# EAGLE design Arduino Engine Room (EAGLE 6.2)
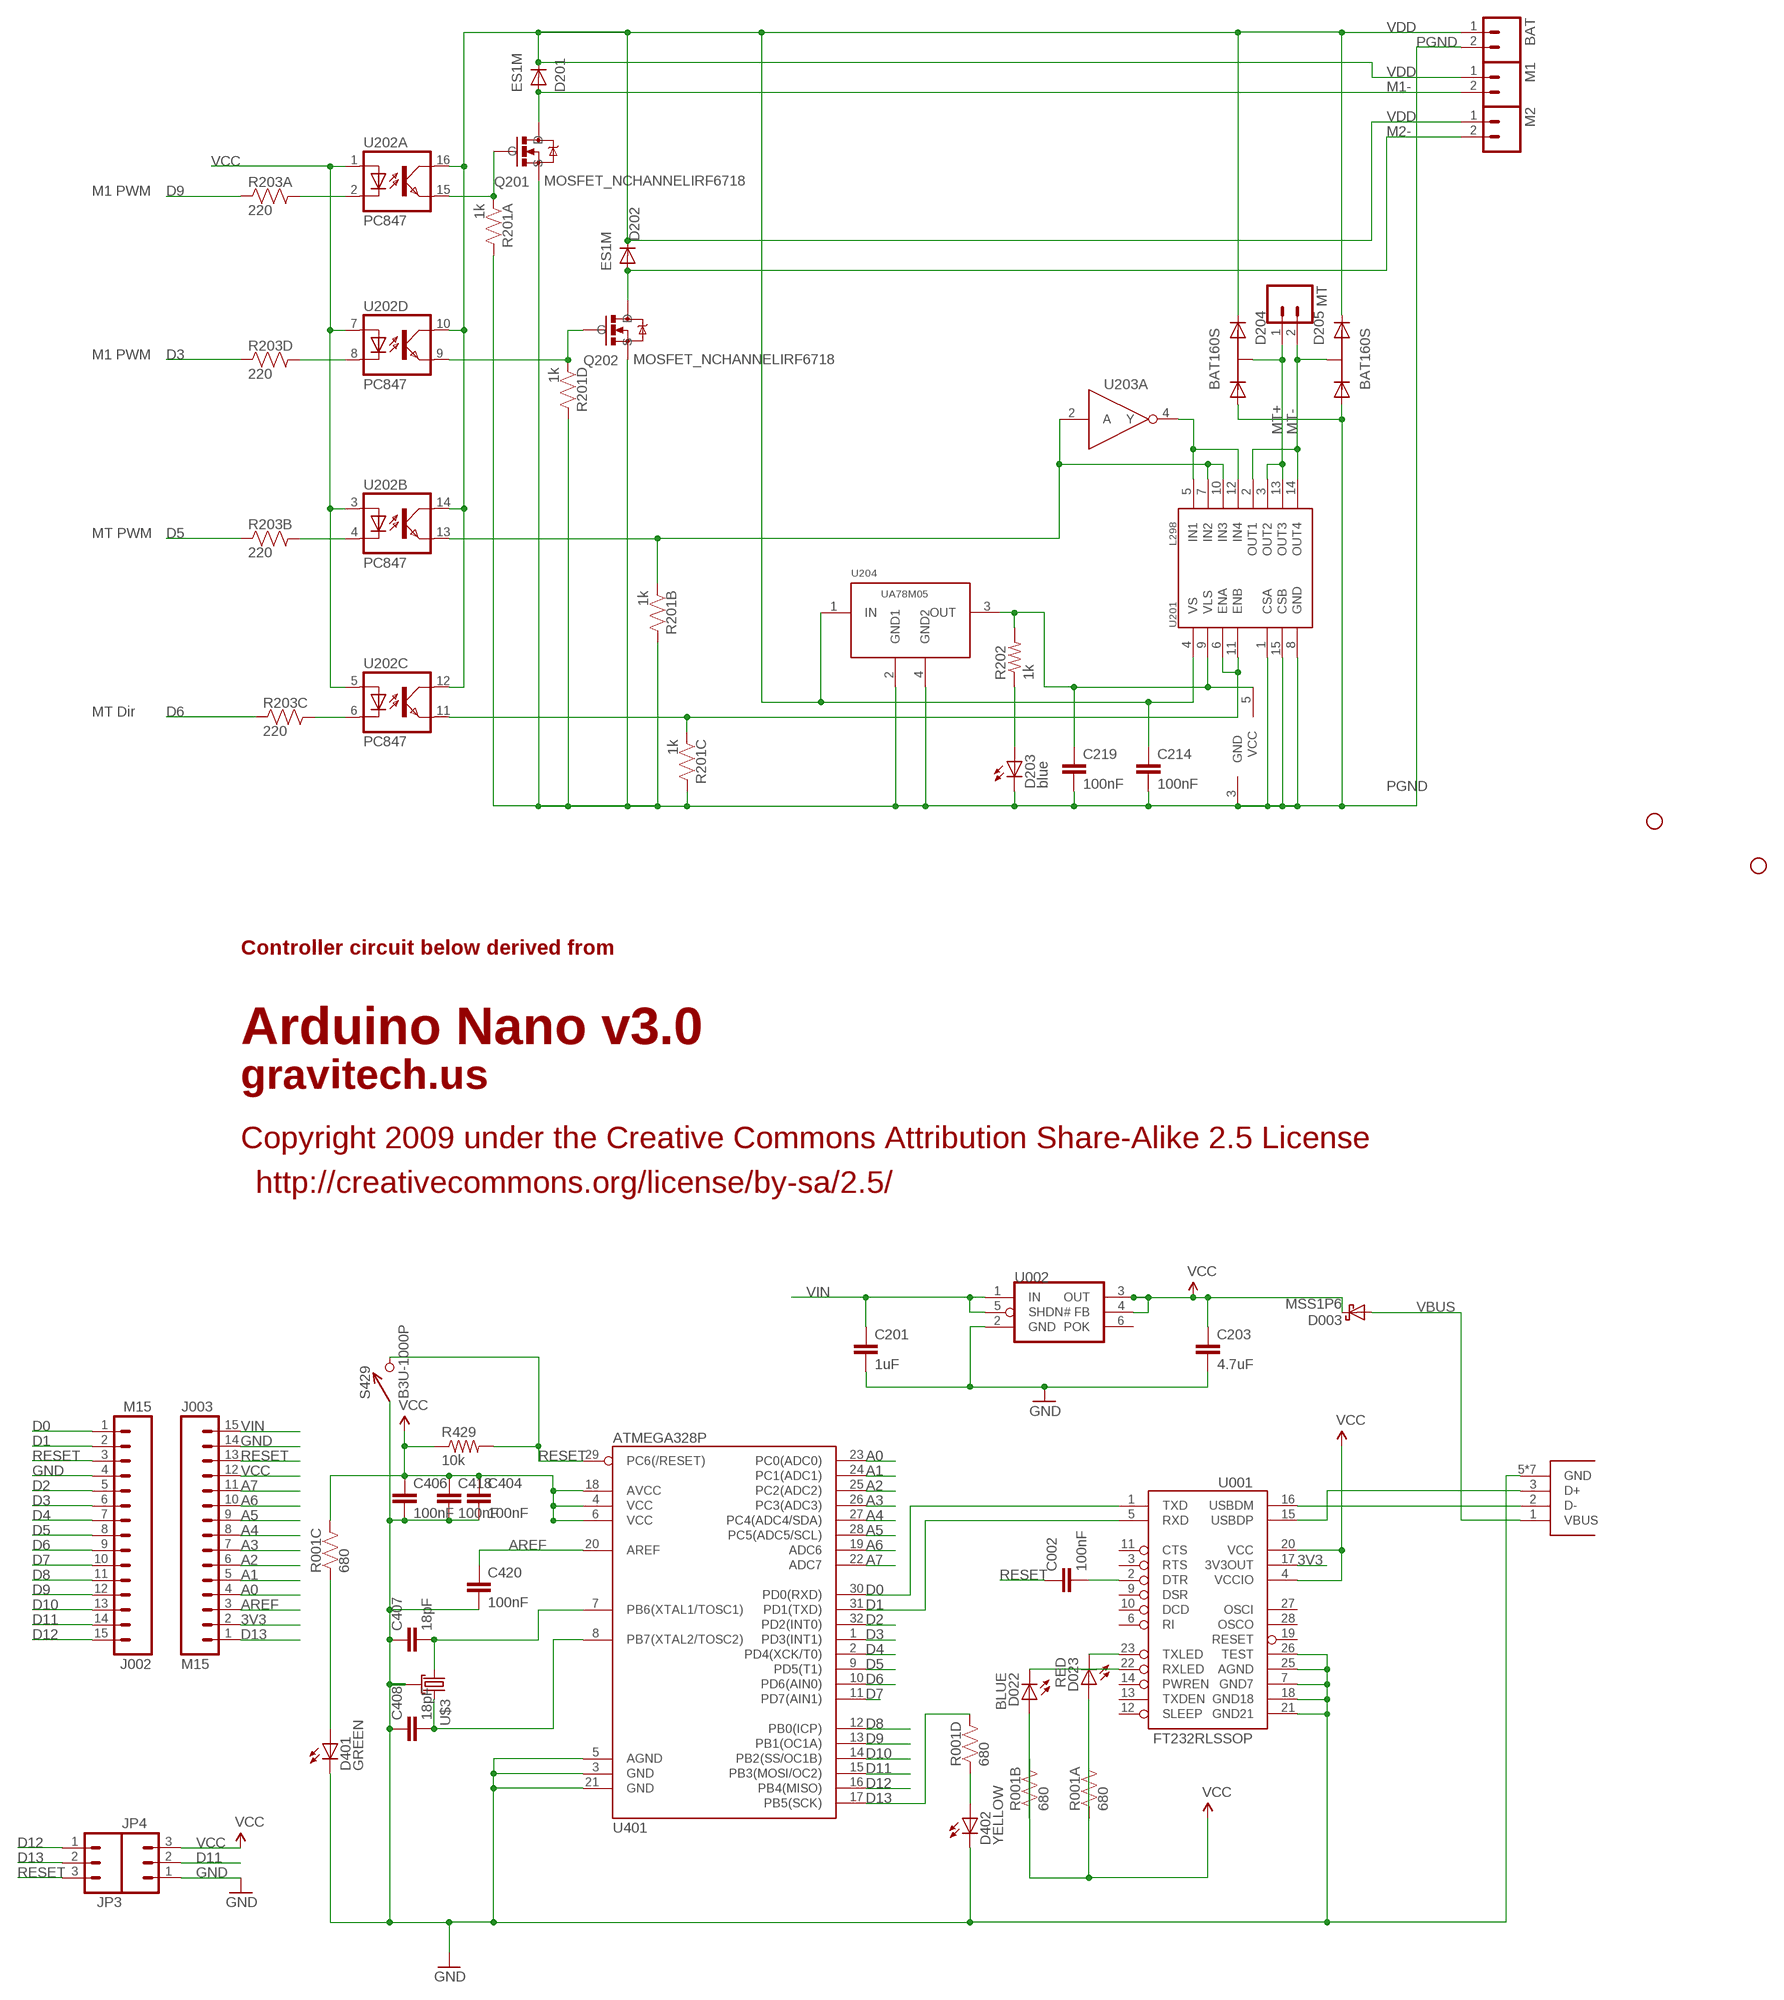
[diagram p0: schematic, sheet 1]

## Parts
BAT  M02PTH4  [1X02_XTRA_BIG]
C002  100nF  CAP0402-CAP  [0402-CAP]
C201  1uF  CAP0402-CAP  [0402-CAP]
C203  4.7uF  CAP0402-CAP  [0402-CAP]
C214  100nF  CAP0402-CAP  [0402-CAP]
C219  100nF  CAP0402-CAP  [0402-CAP]
C404  100nF  CAP0402-CAP  [0402-CAP]
C406  100nF  CAP0402-CAP  [0402-CAP]
C407  18pF  CAP0402-CAP  [0402-CAP]
C408  18pF  CAP0402-CAP  [0402-CAP]
C418  100nF  CAP0402-CAP  [0402-CAP]
C420  100nF  CAP0402-CAP  [0402-CAP]
D003  MSS1P6  [MICROSMP]
D022  BLUE  LED0603  [LED-0603]
D023  RED  LED0603  [LED-0603]
D201  ES1M  DIODE-DO-214AC  [DO-214AC]
D202  ES1M  DIODE-DO-214AC  [DO-214AC]
D203  blue  LED0603  [LED-0603]
D204  BAT160S  [SOT-223]
D205  BAT160S  [SOT-223]
D401  GREEN  LED0603  [LED-0603]
D402  YELLOW  LED0603  [LED-0603]
J001  USB_MICROB_JSTGCT  [USB_MICROB_3075]
J002  M15  [1X15]
J003  M15  [1X15]
JP1  STAND-OFF  [STAND-OFF]
JP2  STAND-OFF  [STAND-OFF]
JP3  M03PTH  [1X03]
JP4  M03PTH  [1X03]
M1  M02PTH4  [1X02_XTRA_BIG]
M2  M02PTH4  [1X02_XTRA_BIG]
MT  M02PTH  [1X02]
Q201  MOSFET_NCHANNELIRF6718  [DIRECTFET_L6]
Q202  MOSFET_NCHANNELIRF6718  [DIRECTFET_L6]
R001  680  RP404  [CRA04]
R201  1k  RP404  [CRA04]
R202  1k  RESISTOR0402-RES  [0402-RES]
R203  220  RP404  [CRA04]
R429  10k  RESISTOR0402-RES  [0402-RES]
S429  B3U-1000P  [B3U-1000P]
U001  FT232RLSSOP  [SSOP28DB]
U002  MAX8881  [SOT-23-6]
U201  L298  [MULTIWATT15]
U202  PC847  [DIL16]
U203  MC74VHC1G04  [SOT-23-5]
U204  UA78M05  [SOT223]
U401  ATMEGA328P  ATMEGA168  [TQFP32-08]
U$3  CX2520  [CRYSTAL_SMD_2MM_2_5MM]

## Nets
3V3: J003.2 U001.17(3V3OUT)
A0: J003.4 U401.23(PC0(ADC0))
A1: J003.5 U401.24(PC1(ADC1))
A2: J003.6 U401.25(PC2(ADC2))
A3: J003.7 U401.26(PC3(ADC3))
A4: J003.8 U401.27(PC4(ADC4/SDA))
A5: J003.9 U401.28(PC5(ADC5/SCL))
A6: J003.10 U401.19(ADC6)
A7: J003.11 U401.22(ADC7)
AREF: C420.1 J003.3 U401.20(AREF)
D0: J002.1 U001.1(TXD) U401.30(PD0(RXD))
D1: J002.2 U001.5(RXD) U401.31(PD1(TXD))
D2: J002.5 U401.32(PD2(INT0))
D3: J002.6 R203.4 U401.1(PD3(INT1))
D3_ISO: R203.5 U202.8(D:C)
D4: J002.7 U401.2(PD4(XCK/T0))
D5: J002.8 R203.2 U401.9(PD5(T1))
D5_ISO: R203.7 U202.4(B:C)
D6: J002.9 R203.3 U401.10(PD6(AIN0))
D6_ISO: R203.6 U202.6(C:C)
D7: J002.10 U401.11(PD7(AIN1))
D8: J002.11 U401.12(PB0(ICP))
D9: J002.12 R203.1 U401.13(PB1(OC1A))
D9_ISO: R203.8 U202.2(A:C)
D10: J002.13 U401.14(PB2(SS/OC1B))
D11: J002.14 JP4.2 U401.15(PB3(MOSI/OC2))
D12: J002.15 JP3.1 U401.16(PB4(MISO))
D13: J003.1 JP3.2 R001.5 U401.17(PB5(SCK))
DTR#: C002.2 U001.2(DTR)
GND: C201.2 C203.2 C404.2 C406.2 C407.1 C408.1 C418.2 C420.2 D401.C D402.C J001.5(GND) J001.P$1(GND) J001.P$2(GND) J001.P$3(GND) J001.P$4(GND) J001.P$8(GND) J001.P$10(GND) J002.4 J003.14 JP4.1 S429.P$1 U001.7(GND7) U001.18(GND18) U001.21(GND21) U001.25(AGND) U001.26(TEST) U002.2(GND) U401.3(GND) U401.5(AGND) U401.21(GND) U$3.2(GND) U$3.4(GND)
M1- [power]: D201.A M1.2 Q201.D1(D) Q201.D2(D)
M2- [power]: D202.A M2.2 Q202.D1(D) Q202.D2(D)
MT+ [lt_power]: D204.4(K1A2) MT.1 U201.3(OUT2) U201.13(OUT3)
MT- [lt_power]: D205.4(K1A2) MT.2 U201.2(OUT1) U201.14(OUT4)
N$1: D203.A R202.1
N$2: U201.5(IN1) U201.12(IN4) U203.4(A:Y)
N$3: C407.2 U401.7(PB6(XTAL1/TOSC1)) U$3.1
N$4: C408.2 U401.8(PB7(XTAL2/TOSC2)) U$3.3
N$5: J001.3(D+) U001.15(USBDP)
N$6: J001.2(D-) U001.16(USBDM)
N$7: D401.A R001.3
N$8: D402.A R001.4
N$9: D022.A R001.2
N$10: C219.1 R202.2 U201.9(VLS) U203.5(PWR:VCC) U204.3(OUT)
N$11: D023.A R001.1
N$28: R201.3 U201.6(ENA) U201.11(ENB) U202.11(C:EMIT)
N$35: Q201.G R201.1 U202.15(A:EMIT)
N$36: Q202.G R201.4 U202.9(D:EMIT)
N$37: R201.2 U201.7(IN2) U201.10(IN3) U202.13(B:EMIT) U203.2(A:A)
PGND [power]: BAT.2 C214.2 C219.2 D203.C D204.1(A1) D205.1(A1) Q201.S Q202.S R201.5 R201.6 R201.7 R201.8 U201.1(CSA) U201.8(GND) U201.15(CSB) U203.3(PWR:GND) U204.2(GND1) U204.4(GND2)
RESET: C002.1 J002.3 J003.13 JP3.3 R429.2 S429.P$2 U401.29(PC6(/RESET))
RXLED1: D022.C U001.22(RXLED)
TXLED1: D023.C U001.23(TXLED)
VBUS: D003.A J001.1(VBUS)
VCC: C203.1 C404.1 C406.1 C418.1 D003.K J003.12 JP4.3 R001.6 R001.7 R001.8 R429.1 U001.4(VCCIO) U001.20(VCC) U002.3(OUT) U002.4(FB) U202.1(A:A) U202.3(B:A) U202.5(C:A) U202.7(D:A) U401.4(VCC) U401.6(VCC) U401.18(AVCC)
VDD [power]: BAT.1 C214.1 D201.C D202.C D204.3(K2) D205.3(K2) M1.1 M2.1 U201.4(VS) U202.10(D:COL) U202.12(C:COL) U202.14(B:COL) U202.16(A:COL) U204.1(IN)
VIN: C201.1 J003.15 U002.1(IN) U002.5(SHDN#)
Unconnected: U001.3(RTS) U001.6(RI) U001.9(DSR) U001.10(DCD) U001.11(CTS) U001.12(SLEEP) U001.13(TXDEN) U001.14(PWREN) U001.19(RESET) U001.27(OSCI) U001.28(OSCO) U002.6(POK)

## Notes on the sheet
- M1 PWM
- M1 PWM
- MT PWM
- MT Dir
- Controller circuit below derived from
- Arduino Nano v3.0
- gravitech.us
- Copyright 2009 under the Creative Commons Attribution Share-Alike 2.5 License
- http://creativecommons.org/license/by-sa/2.5/

## Library data of the parts
BAT M1 M2 MT = SparkFun:M02: Header 2 Standard 2-pin 0.1" header. Use with straight break away headers (SKU : PRT-00116), right angle break away headers (PRT-00553), swiss pins (PRT-00743), machine pins (PRT-00117), and female headers (PRT-00115). Molex polarized connector foot print use with SKU : PRT-08233 with associated crimp pins and housings.
C002 C404 C406 C418 C420 = SparkFun:CAP: Capacitor Standard 0603 ceramic capacitor, and 0.1" leaded capacitor.; DIGIKEY: 445-1268-1-ND
C201 = SparkFun:CAP: Capacitor Standard 0603 ceramic capacitor, and 0.1" leaded capacitor.; DIGIKEY: 445-1415-1-ND
C203 = SparkFun:CAP: Capacitor Standard 0603 ceramic capacitor, and 0.1" leaded capacitor.; DIGIKEY: 445-7395-1-ND
C214 C219 = SparkFun:CAP: Capacitor Standard 0603 ceramic capacitor, and 0.1" leaded capacitor.
C407 C408 = SparkFun:CAP: Capacitor Standard 0603 ceramic capacitor, and 0.1" leaded capacitor.; DIGIKEY: 445-1238-1-ND
D003 = KwanSystems:MSS1P6; DIGIKEY: MSS1P6-M3/89AGICT-ND
D022 = SparkFun-LED:LED: LEDs Standard schematic elements and footprints for 5mm, 3mm, 1206, and 0603 sized LEDs. 5mm - Spark Fun Electronics SKU : COM-00529 (and others); DIGIKEY: 350-2037-1-ND
D023 = SparkFun-LED:LED: LEDs Standard schematic elements and footprints for 5mm, 3mm, 1206, and 0603 sized LEDs. 5mm - Spark Fun Electronics SKU : COM-00529 (and others); DIGIKEY: 754-1359-1-ND
D201 D202 = diode:DIODE-: DIODE
D203 = SparkFun:LED: LEDs Standard schematic elements and footprints for 5mm, 3mm, 1206, and 0603 sized LEDs. 5mm - Spark Fun Electronics SKU : COM-00529 (and others)
D204 D205 = KwanSystems:BAT160S
D401 = SparkFun-LED:LED: LEDs Standard schematic elements and footprints for 5mm, 3mm, 1206, and 0603 sized LEDs. 5mm - Spark Fun Electronics SKU : COM-00529 (and others); DIGIKEY: 350-2036-1-ND
D402 = SparkFun-LED:LED: LEDs Standard schematic elements and footprints for 5mm, 3mm, 1206, and 0603 sized LEDs. 5mm - Spark Fun Electronics SKU : COM-00529 (and others); DIGIKEY: 754-1124-1-ND
J001 = KwanSystems:USB_MICROB_JST; DIGIKEY: 455-2562-1-ND
J002 J003 = SparkFun-Connectors:M15: Header 15 Standard 15-pin 0.1" header. Use with straight break away headers (SKU : PRT-00116), right angle break away headers (PRT-00553), swiss pins (PRT-00743), machine pins (PRT-00117), and female headers (PRT-00115).; DIGIKEY: $NOPART
JP1 JP2 = SparkFun:STAND-OFF: Stand Off This is the mechanical footprint for a #4 phillips button head screw. Use the keepout ring to avoid running the screw head into surrounding components. SKU : PRT-00447
JP3 JP4 = SparkFun-Connectors:M03: Header 3 Standard 3-pin 0.1" header. Use with straight break away headers (SKU : PRT-00116), right angle break away headers (PRT-00553), swiss pins (PRT-00743), machine pins (PRT-00117), and female headers (PRT-00115). Molex polarized connector foot print use with SKU : PRT-08232 with associated crimp pins and housings.; DIGIKEY: $NOPART
Q201 Q202 = KwanSystems:MOSFET_NCHANNEL
R001 = KwanSystems:RP4; DIGIKEY: CRA4S8680CT-ND
R201 R203 = KwanSystems:RP4
R202 = SparkFun:RESISTOR: Resistor Basic schematic elements and footprints for 0603, 1206, and PTH resistors.
R429 = SparkFun-Passives:RESISTOR: Resistor Basic schematic elements and footprints for 0603, 1206, and PTH resistors.; DIGIKEY: P10.0KLCT-ND
S429 = KwanSystems:B3U-1000P
U001 = SparkFun-DigitalIC:FT232RL: USB UART FT232RL 4th Generation USB UART (USB <-> Serial) Controller. Spark Fun Electronics SKU : COM-00650 Production SKU IC-00870; DIGIKEY: 768-1007-1-ND; PROD_ID: IC-00870
U002 = KwanSystems:MAX8881; DIGIKEY: MAX8881EUT50+TCT-ND
U201 = SparkFun:L298: L298 Dual Full Bridge Driver
U202 = optocoupler:PC847: SHARP OPTO COUPLER
U203 = KwanSystems:MC74VHC1G04
U204 = MySMD:UA78M05
U401 = SparkFun-DigitalIC:ATMEGA168: Atmel 32-pin 8-bit micro, 16k flash.; DIGIKEY: ATMEGA328P-15AZCT-ND
U$3 = KwanSystems:CX2520

## Net classes
0 default: width 0.152 mm, drill 0.33 mm, clearance 0.152 mm
1 power: width 0.152 mm, drill 0.33 mm, clearance 0.152 mm to class 0, clearance 0.152 mm
2 lt_power: width 0.152 mm, drill 0.33 mm, clearance 0.254 mm to class 0, clearance 0.254 mm to class 1, clearance 0.254 mm

## Board
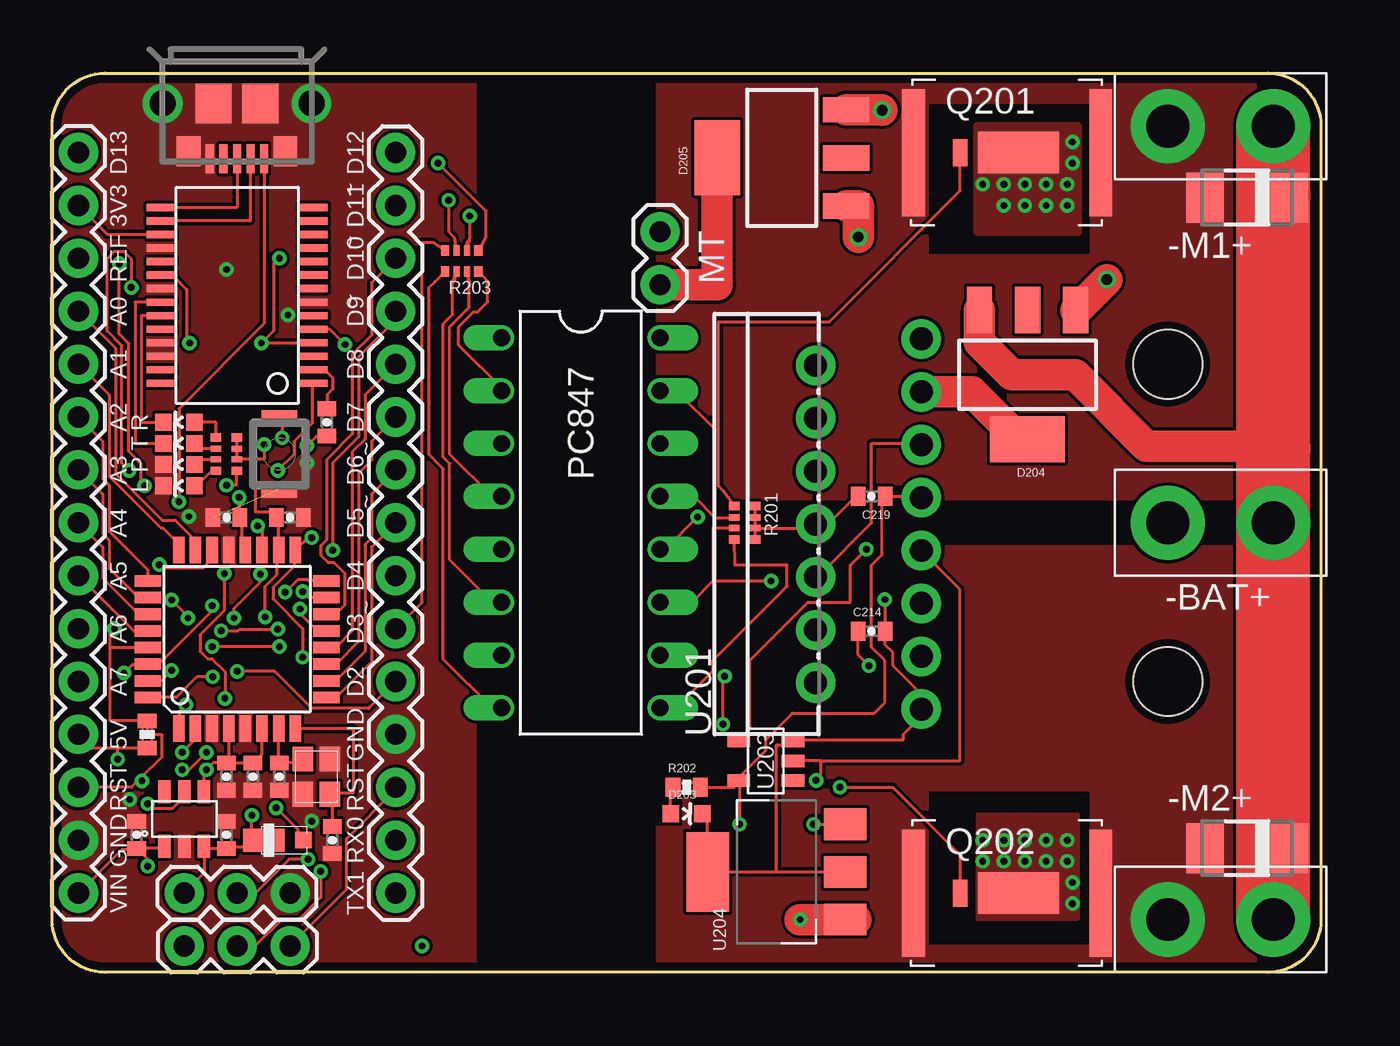
[diagram p1: board, top side]
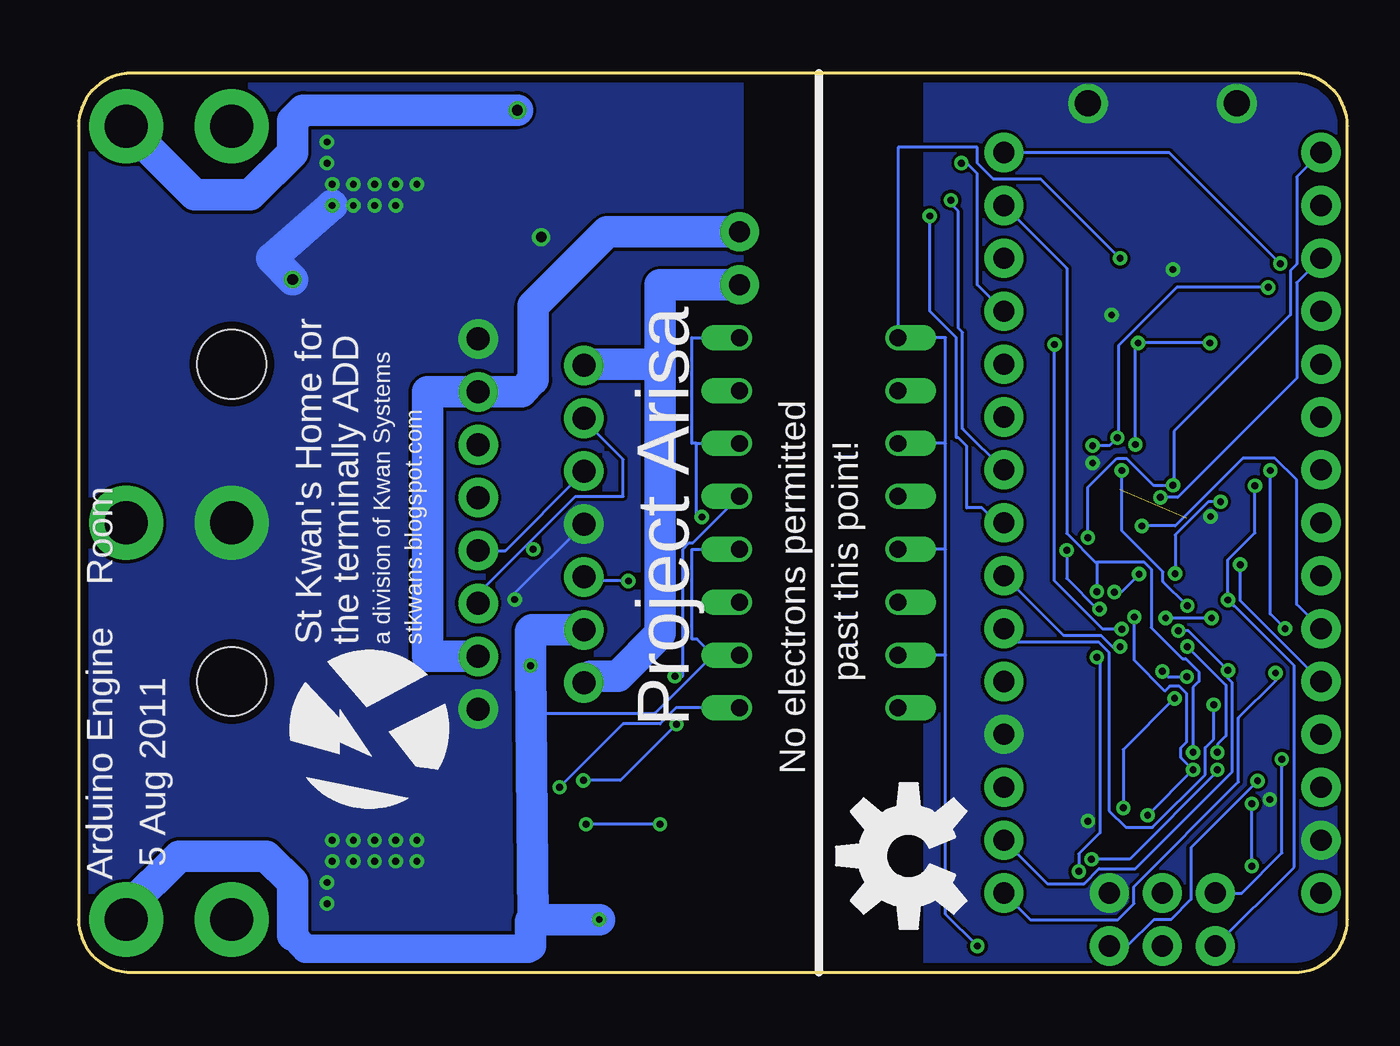
[diagram p2: board, bottom side, seen from below]

Size 60.96 x 43.18 mm. Coordinates in mm from the lower left corner, seen from the top.
Outline: 2.54,43.18 58.42,43.18 arc-90 60.96,40.64 60.96,2.54 arc-90 58.42,0 2.54,0 arc-90 0,2.54 0,40.64 arc-90 2.54,43.18
Copper layers (1*16): Top 0.0356mm / dielectric 1.5011mm / Bottom 0.0356mm
Design rules: minimum track width 6mil, minimum drill 13mil, track to track 6mil, track to pad 6mil, pad to pad 6mil, via to via 6mil, smd to smd 6mil, copper to edge 15mil, drill to drill 6mil, minimum pad ring 7mil, minimum via ring 7mil, stop-mask expansion 4mil, vias tented up to drill 21mil, thermal gap 10mil
tRestrict: area 22.1,0 to 28.7,43.2
bRestrict: area 22.1,0 to 28.7,43.2

### Footprints (pad centres in the part's own frame; a part is rotated, then mirrored left to right if it is on the bottom)
1X02_XTRA_BIG = drill 2.057 pad 3.556: 1 -2.54,0; 2 2.54,0
0402-CAP = smd 0.7 x 0.9: 1 -0.65,0; 2 0.65,0
MICROSMP = smd 0.8 x 0.8: A 0.9,0 | smd 2 x 1.1: K -1,0
LED-0603 = smd 0.8 x 0.8: A 0,-0.75; C 0,0.75
DO-214AC = smd 1.8 x 2.4: A 2.025,0; C -2.025,0
SOT-223 = smd 1.219 x 2.235: 1 -2.311,-3.099; 2 0,-3.099; 3 2.311,-3.099 | smd 3.6 x 2.2: 4 0,3.099
USB_MICROB_3075 = smd 0.4 x 1.4: 1 -1.3,4.1; 2 -0.65,4.1; 3 0,4.1; 4 0.65,4.1; 5 1.3,4.1 | smd 1.15 x 1.45: P$1 2.32,3.75; P$10 -2.32,3.75 | smd 1.75 x 1.9: P$2 1.125,1.45; P$8 -1.125,1.45 | drill 1.25 pad 1.9: P$3 -3.575,1.45; P$4 3.575,1.45
1X15 = drill 1.016 pad 1.88: 1 0,0; 2 2.54,0; 3 5.08,0; 4 7.62,0; 5 10.16,0; 6 12.7,0; 7 15.24,0; 8 17.78,0; 9 20.32,0; 10 22.86,0; 11 25.4,0; 12 27.94,0; 13 30.48,0; 14 33.02,0; 15 35.56,0
STAND-OFF = hole 3.302: 0,0
1X03 = drill 1.016 pad 1.88: 1 0,0; 2 2.54,0; 3 5.08,0
1X02 = drill 1.016 pad 1.88: 1 0,0; 2 2.54,0
DIRECTFET_L6 = smd 1.1 x 6.1: D1 -4.35,0; D2 4.65,0 | smd 0.7 x 1.3: G -2.1,0 | smd 3.9 x 2: S 0.7,0
CRA04 = smd 0.4 x 0.5: 1 -0.8,-0.5; 4 0.8,-0.5; 5 0.8,0.5; 8 -0.8,0.5 | smd 0.3 x 0.5: 2 -0.25,-0.5; 3 0.25,-0.5; 6 0.25,0.5; 7 -0.25,0.5
0402-RES = smd 0.7 x 0.9: 1 -0.65,0; 2 0.65,0
B3U-1000P = smd 0.8 x 1.7: P$1 -1.7,0; P$2 1.7,0
SSOP28DB = smd 0.348 x 1.397: 1 -4.225,-3.656; 2 -3.575,-3.656; 3 -2.925,-3.656; 4 -2.275,-3.656; 5 -1.625,-3.656; 6 -0.975,-3.656; 7 -0.325,-3.656; 8 0.325,-3.656; 9 0.975,-3.656; 10 1.625,-3.656; 11 2.275,-3.656; 12 2.925,-3.656; 13 3.575,-3.656; 14 4.225,-3.656; 15 4.225,3.656; 16 3.575,3.656; 17 2.925,3.656; 18 2.275,3.656; 19 1.625,3.656; 20 0.975,3.656; 21 0.325,3.656; 22 -0.325,3.656; 23 -0.975,3.656; 24 -1.625,3.656; 25 -2.275,3.656; 26 -2.925,3.656; 27 -3.575,3.656; 28 -4.225,3.656
SOT-23-6 = smd 0.6 x 1.1: 1 -0.95,-1.3; 2 0,-1.3; 3 0.95,-1.3; 4 0.95,1.3; 5 0,1.3; 6 -0.95,1.3
MULTIWATT15 = drill 1.1 pad 1.9: 1 -8.95,-2.39; 2 -7.68,2.69; 3 -6.41,-2.39; 4 -5.14,2.69; 5 -3.87,-2.39; 6 -2.6,2.69; 7 -1.33,-2.39; 8 -0.06,2.69; 9 1.21,-2.39; 10 2.48,2.69; 11 3.75,-2.39; 12 5.02,2.69; 13 6.29,-2.39; 14 7.56,2.69; 15 8.83,-2.39
DIL16 = drill 0.813 offset: 1 -8.89,-3.81; 2 -6.35,-3.81; 3 -3.81,-3.81; 4 -1.27,-3.81; 5 1.27,-3.81; 6 3.81,-3.81; 7 6.35,-3.81; 8 8.89,-3.81; 9 8.89,3.81; 10 6.35,3.81; 11 3.81,3.81; 12 1.27,3.81; 13 -1.27,3.81; 14 -3.81,3.81; 15 -6.35,3.81; 16 -8.89,3.81
SOT-23-5 = smd 0.6 x 1.1: 1 -0.95,-1.3; 2 0,-1.3; 3 0.95,-1.3; 4 0.95,1.3; 5 -0.95,1.3
SOT223 = smd 1.524 x 2.032: 1 0,0; 2 2.286,0; 3 4.572,0 | smd 3.81 x 2.032: 4 2.286,6.604
TQFP32-08 = smd 1.27 x 0.559: 1 -4.293,2.8; 2 -4.293,2; 3 -4.293,1.2; 4 -4.293,0.4; 5 -4.293,-0.4; 6 -4.293,-1.2; 7 -4.293,-2; 8 -4.293,-2.8; 17 4.293,-2.8; 18 4.293,-2; 19 4.293,-1.2; 20 4.293,-0.4; 21 4.293,0.4; 22 4.293,1.2; 23 4.293,2; 24 4.293,2.8 | smd 0.559 x 1.27: 9 -2.8,-4.293; 10 -2,-4.293; 11 -1.2,-4.293; 12 -0.4,-4.293; 13 0.4,-4.293; 14 1.2,-4.293; 15 2,-4.293; 16 2.8,-4.293; 25 2.8,4.293; 26 2,4.293; 27 1.2,4.293; 28 0.4,4.293; 29 -0.4,4.293; 30 -1.2,4.293; 31 -2,4.293; 32 -2.8,4.293
CRYSTAL_SMD_2MM_2_5MM = smd 1.2 x 1: 1 -0.85,-0.65; 2 0.85,-0.65; 3 0.85,0.65; 4 -0.85,0.65

### Placement (x,y rotation side)
BAT  56.13,21.59 180 top
C002  13.21,26.42 90 top
C201  4.06,6.6 90 top
C203  8.38,6.6 90 top
C214  39.37,16.38 0 top
C219  39.37,22.86 180 top
C404  8.38,9.4 270 top
C406  9.65,9.4 270 top
C407  10.92,9.4 90 top
C408  13.46,6.35 90 top
C418  11.43,21.84 0 top
C420  8.38,21.84 180 top
D003  11.18,6.35 0 top
D022  6.1,25.4 90 top
D023  6.1,26.42 90 top
D201  57.4,37.21 180 top
D202  57.4,5.97 180 top
D203  30.48,7.62 270 top
D204  46.86,28.7 180 top
D205  35.05,39.12 90 top
D401  6.1,24.38 90 top
D402  6.1,23.37 90 top
J001  8.89,43.18 180 top
J002  16.51,3.81 90 top
J003  1.27,39.37 270 top
JP1  53.59,13.97 0 top
JP2  53.59,29.21 90 top
JP3  6.35,1.27 0 top
JP4  11.43,3.81 180 top
M1  56.13,40.64 180 top
M2  56.13,2.54 180 top
MT  29.21,35.56 270 top
Q201  45.72,39.37 0 top
Q202  45.72,3.81 0 top
R001  8.38,24.89 270 top
R201  33.27,21.59 270 top
R202  30.48,8.89 0 top
R203  19.68,34.16 180 top
R429  4.57,11.43 90 top
S429  10.92,24.89 90 top
U001  8.89,32.51 90 top
U002  6.35,7.37 0 top
U201  39.37,21.59 90 top
U202  25.4,21.59 270 top
U203  34.29,10.16 90 top
U204  38.1,2.54 90 top
U401  8.89,16 90 top
U$1  [KWAN_CIRCLE]  46.99,11.68 90 bottom
U$2  [OSHW-LOGO-L]  21.08,5.59 90 bottom
U$3  12.7,9.4 270 top

### Tracks (layer width: path | path; a pad name or v marks a point on that pad's centre or on a via)
3V3
  Top 0.152: J003.2 2.64,35.46 5.23,35.46 U001.17
A0
  Top 0.152: J003.4 3.05,29.97 3.05,23.95 5.28,21.72 5.92,21.72 6.88,20.75 U401.23
A1
  Top 0.152: J003.5 2.74,27.74 2.74,23.82 5.23,21.34 5.33,21.34 5.84,20.83 6.07,20.83 6.07,20.3 U401.24
A2
  Top 0.152: U401.25 4.6,19.33 2.74,21.18 2.74,23.39 2.44,23.7 2.44,25.5 J003.6
A3
  Top 0.152: J003.7 2.44,22.96 2.44,21.06 2.74,20.75 2.74,19.41 4.14,18.01 U401.26
A4
  Top 0.152: J003.8 2.44,20.42 2.44,18.92 4.14,17.22 4.6,17.22 U401.27
A5
  Top 0.152: J003.9 3.91,16.41 U401.28
A6  (via drill 0.33)
  Top 0.152: v9.88,21.44 10.08,21.23 U401.19
  Bottom 0.152: v9.88,21.44 8.28,21.44 5.03,24.69 3.48,24.69 2.44,23.65 2.44,17.68 J003.10
A7  (via drill 0.33)
  Top 0.152: v5.16,19.58 5.31,19.43 7.26,19.43 7.67,19.84 7.67,20.3 U401.22
  Bottom 0.152: v5.16,19.58 5.16,17.86 J003.11
AREF  (via drill 0.33)
  Top 0.152: 9.04,21.84 C420.1 | v8.99,22.81 8.99,21.89 C420.1 | U401.20 9.14,20.3 9.14,21.84 C420.1
  Bottom 0.152: v8.99,22.81 8.15,22.81 2.44,28.52 2.44,33.12 J003.3
D0  (via drill 0.33)
  Top 0.152: v3.45,14.38 3.86,14.78 4.6,14.78 U401.30 4.65,14.83 5.16,14.83 7.7,17.37 v7.7,17.6 | v10.85,24.11 11.66,24.92 11.66,25.53 12.52,26.39 12.52,28.27 U001.1
  Bottom 0.152: v3.45,14.38 3.45,13.99 5.23,12.22 5.23,9.14 10.26,4.12 10.26,3.3 11.02,2.54 15.24,2.54 J002.1 | v10.85,24.11 10.85,21.21 8.87,19.23 8.87,18.77 v7.7,17.6
D1  (via drill 0.33)
  Top 0.152: v5.74,14.5 5.26,14.02 4.6,14.02 U401.31 | v14.07,30.15 13.34,30.89 U001.5 | v10.85,16.48 9.02,16.48 8.94,16.41 v8.13,16.41
  Bottom 0.152: J002.2 14.43,4.27 12.65,4.27 11.94,4.98 10.19,4.98 5.54,9.63 5.54,13.92 5.74,14.12 v5.74,14.5 7.64,16.41 v8.13,16.41 | v14.07,30.15 14.07,18.8 11.76,16.48 v10.85,16.48
D2  (via drill 0.33)
  Top 0.152: J002.5 15.21,12.68 12.47,12.68 10.69,14.45 v8.89,14.45 | v7.72,14.2 6.96,14.2 5.97,13.21 U401.32
  Bottom 0.152: v8.89,14.45 8.64,14.2 v7.72,14.2
D3  (via drill 0.33)
  Top 0.152: J002.6 17.78,17.78 17.78,35.05 18.29,35.05 R203.4 | v6.43,12.85 6.1,12.52 U401.1
  Bottom 0.152: v6.43,12.85 6.43,11.2 6.83,10.79 6.83,9.5 9.37,6.96 10.64,6.96 11.46,7.77 11.46,15.37 11.96,15.88 15.88,15.88 J002.6
D3_ISO
  Top 0.152: U202.8 21.13,12.7 18.8,15.04 18.8,24.18 18.11,24.87 18.11,32.89 18.39,33.17 R203.5
D4  (via drill 0.33)
  Top 0.152: v10.92,15.65 v7.7,15.65 | U401.2 6.88,11.2 v6.25,10.57
  Bottom 0.152: v6.25,10.57 6.25,10.95 5.84,11.35 5.84,13.79 v7.7,15.65 | v10.92,15.65 11.3,15.65 11.84,16.18 13.64,16.18 J002.7
D5  (via drill 0.33)
  Top 0.152: 19.94,35.09 R203.2 20.07,35.31 v20.07,36.32 | J002.8 15.34,20.42 15.34,14.91 13.64,13.21 U401.9
  Bottom 0.152: J002.8 16.84,21.59 17.55,22.3 18.29,22.3 18.29,25.27 18.69,25.68 18.8,25.68 18.8,30.48 20.07,31.75 v20.07,36.32
D5_ISO
  Top 0.152: 20.07,33.02 R203.7 20.07,32.94 20.04,32.92 20.04,31.95 19.1,31.01 19.1,24.89 21.13,22.86 U202.4
D6  (via drill 0.33)
  Top 0.152: v19.05,37.08 19.05,35.56 19.3,35.31 R203.3 | J002.9 15.34,22.96 15.34,20.85 15.04,20.55 15.04,15.42 13.64,14.02 13.18,14.02 U401.10
  Bottom 0.152: v19.05,37.08 19.05,36.83 18.97,36.83 18.69,36.55 18.69,30.94 18.49,30.73 18.49,26.09 18.47,26.09 J002.9
D6_ISO
  Top 0.152: 19.25,33.15 19.28,33.17 R203.6 19.25,33.1 19.25,31.6 18.8,31.14 18.8,24.74 19.1,24.43 19.1,19.81 21.13,17.78 U202.6
D7
  Top 0.152: J002.10 15.34,25.5 15.34,24.59 14.73,23.98 14.73,15.9 13.64,14.81 U401.11
D8
  Top 0.152: J002.11 15.04,27.74 15.04,25.6 14.43,24.99 14.43,16.41 13.64,15.62 13.18,15.62 U401.12
D9  (via drill 0.33)
  Top 0.152: v18.54,38.86 20.83,36.58 20.83,35.31 R203.1 | v11.91,17.45 11.91,17.22 12.72,16.41 U401.13 | v13.49,20.27 13.49,24.49 14.73,25.73 14.73,29.57 16.51,31.34 J002.12
  Bottom 0.152: J002.12 17.78,33.02 17.78,38.35 18.29,38.86 v18.54,38.86 | v11.91,17.45 12.01,17.45 13.49,18.92 v13.49,20.27
D9_ISO
  Top 0.152: R203.8 20.95,33.17 20.93,33.15 20.93,32.21 20.45,31.73 20.24,31.73 19.53,31.01 19.53,30.12 21.59,28.07 U202.2
D10
  Top 0.152: J002.13 15.34,33.12 15.34,30.61 14.43,29.69 14.43,25.86 13.18,24.61 13.18,20.78 12.9,20.5 12.9,20.04 13.26,19.68 13.54,19.68 14.05,19.18 14.05,17.63 13.64,17.22 13.18,17.22 U401.14
D11  (via drill 0.33)
  Top 0.152: v12.04,18.29 12.32,18.01 U401.15 | JP4.2 9.75,3.81 11.38,5.44 v12.29,5.44 | v6.25,9.73 6.58,9.73 v7.42,10.57
  Bottom 0.152: v12.04,18.29 12.04,19.63 12.06,19.66 | 12.06,19.66 13.49,21.08 13.49,33.81 J002.14 | v12.29,5.44 10.46,5.44 6.25,9.65 v6.25,9.73 | v7.42,10.57 7.42,13.69 7.14,13.97 7.14,14.43 7.77,15.06 7.92,15.06 9.42,16.56 9.42,19.36 9.78,19.71 12.01,19.71 12.06,19.66
D12  (via drill 0.33)
  Top 0.152: v11.2,18.26 11.81,18.87 12.27,18.87 12.32,18.82 13.18,18.82 U401.16 | v10.01,19.13 10.01,18.75 8.74,17.48 v8.74,17.02 | v6.53,17.02 6.53,17.09 v5.74,17.88 | v3.23,34.04 3.23,30.66 3.68,30.2 3.68,25.02 4.29,24.41 4.29,23.52 v4.45,23.37
  Bottom 0.152: v11.2,18.26 10.87,18.26 v10.01,19.13 | v6.53,17.02 v8.74,17.02 | JP3.1 2.56,5.05 2.56,14.73 5.44,17.6 5.46,17.6 v5.74,17.88 5.74,19.81 4.45,21.11 v4.45,23.37 | J002.15 8.56,39.37 v3.23,34.04
D13  (via drill 0.33)
  Top 0.152: v12.47,20.88 12.29,20.88 11.71,20.3 U401.17 11.63,20.24 11.63,19.51 10.62,18.49 10.62,17.93 12.04,16.51 v12.04,15.14 | R001.5 8.84,24.08 8.84,23.39 v8.38,23.39 | JP3.2 9.75,1.27 11.02,2.54 11.84,2.54 12.9,3.61 v12.9,4.85
  Bottom 0.152: v12.47,20.88 12.47,23.29 11.07,24.69 10.62,24.69 9.32,23.39 v8.38,23.39 8.33,23.44 8.33,25.98 2.74,31.57 2.74,33.71 2.44,34.01 2.44,38.2 J003.1 | v12.9,4.85 12.9,5.69 11.89,6.71 11.89,14.99 v12.04,15.14
DTR#
  Top 0.152: C002.2 13.21,27.74 13.49,28.02 13.49,28.55 13.11,28.93 U001.2
GND  (via drill 0.33)  (1 unrouted)
  other vias: 12.24,24.46 11.33,31.57 8.38,33.76 3.73,8.31 6.58,21.89 12.47,7.26
  pour Top (no thermals): 2.54,43.18 20.32,43.18 20.32,0 2.54,0 arc-90 0,2.54 0,40.64 arc-90
  pour Bottom (no thermals): 2.54,43.18 20.32,43.18 20.32,0 2.54,0 arc-90 0,2.54 0,40.64 arc-90
M1-
  pour Top (no thermals): 29.21,43.18 29.21,22.86 60.96,22.86 60.96,43.18 50.04,43.18 50.04,34.29 41.91,34.29 41.91,43.18
  pour Top (no thermals): 40.64,43.18 40.64,41.91 50.8,41.91 50.8,43.18
M2-
  pour Top (no thermals): 60.96,20.32 29.21,20.32 29.21,0 41.91,0 41.91,8.89 50.04,8.89 50.04,0 60.96,0
  pour Top (no thermals): 41.91,1.27 50.8,1.27 50.8,0 41.91,0
MT+
  Top 1.524: D204.4 46.47,25.6 44.2,27.88 U201.13
  Bottom 1.524: U201.3 44.2,15.18 44.2,27.88 U201.13 39.68,27.88 39.12,28.45 39.12,32 35.56,35.56 MT.1
MT-
  Top 1.524: MT.2 31.95,33.02 D205.4
  Bottom 1.524: MT.2 33.02,33.02 33.02,29.21 | U201.14 36.62,29.21 33.02,29.21 | 33.02,29.21 33.02,16.26 35.05,14.22 36.37,14.22 U201.2
N$1
  Top 0.152: D203.A 29.72,7.62 29.72,8.89 R202.1
N$2  (via drill 0.33)
  Top 0.152: v39.12,20.32 38.35,19.56 38.35,17.78 36.32,17.78 33.53,14.99 33.53,11.68 33.02,11.18 U203.4
  Bottom 0.152: 39.37,20.57 41.66,18.29 41.66,17.78 U201.5 | 39.37,20.57 37.08,22.86 34.8,22.86 34.8,24.64 36.58,26.42 U201.12 | v39.12,20.32 39.37,20.57
N$3
  Top 0.152: U401.7 10.9,10.11 C407.2 11.86,10.06 12.04,10.24 12.05,10.24 U$3.1
N$4
  Top 0.152: C408.2 13.46,8.43 13.36,8.53 13.35,8.53 U$3.3 13.44,8.55 13.44,8.64 14.48,8.64 14.48,11.71 U401.8 12.12,11.71
N$5
  Top 0.152: U001.15 5.26,36.75 8.89,36.75 J001.3
N$6
  Top 0.152: J001.2 9.53,38.96 9.53,36.09 5.26,36.09 U001.16
N$7
  Top 0.152: R001.3 7.9,24.64 7.11,24.64 D401.A
N$8
  Top 0.152: D402.A 6.96,23.37 7.67,24.08 7.9,24.08 R001.4
N$9
  Top 0.152: R001.2 6.85,25.14 D022.A
N$10  (via drill 0.33)
  Top 0.152: U201.9 41.66,22.86 C219.1 39.88,22.86 39.88,20.07 39.37,19.56 39.37,15.62 40.01,14.99 40.01,12.95 39.5,12.45 35.56,12.45 34.29,11.18 34.29,10.67 33.02,9.4 U203.5 | v33.02,7.11 33.02,9.14 U203.5 | R202.2 32.77,8.89 32.77,9.14 U203.5 | v36.58,7.11 U204.3
  Bottom 0.152: v33.02,7.11 v36.58,7.11
N$11
  Top 0.152: R001.1 7.88,26.42 D023.A
N$28  (via drill 0.33)
  Top 0.152: U201.6 36.83,19.05 39.37,21.59 39.37,25.4 41.76,25.4 U201.11 | 31.75,18.8 v34.54,18.8 | U202.11 30.73,17.78 31.75,18.8 | 32.8,21.34 R201.3 31.75,21.34 31.75,18.8
  Bottom 0.152: v34.54,18.8 36.58,18.8 U201.6
N$35
  Top 0.152: 32,25.91 32,23.37 32.26,23.11 R201.1 | 32,25.91 29.97,27.94 U202.15 | 32,25.91 32,31.24 37.34,31.24 43.62,37.52 Q201.G 43.43,39.37
N$36  (via drill 0.33)
  Top 0.152: U202.9 29.97,12.7 31.75,14.48 31.75,14.99 35.31,18.54 35.31,19.56 32.8,19.56 R201.4 | 43.43,3.81 Q202.G 43.62,5.66 40.39,8.89 v37.85,8.89
  Bottom 0.152: U202.9 32.26,12.7 33.02,11.94 34.8,11.94 v37.85,8.89
N$37  (via drill 0.33)
  Top 0.152: 36.93,10.16 U203.2 | 36.93,10.16 43.61,10.16 43.61,18.39 41.78,20.22 41.78,20.24 U201.7 | U202.13 30.84,22.86 31.86,21.84 R201.2 | v32.31,14.22 32.23,14.15 v32.23,11.91 | v36.7,9.22 36.93,9.45 36.93,10.16
  Bottom 0.152: U201.10 36.83,23.88 40.45,20.26 U201.7 | U202.13 31.45,20.62 31.62,20.62 31.93,20.32 31.93,14.22 v32.31,14.22 | v32.23,11.91 34.92,9.22 v36.7,9.22
PGND  (via drill 0.33, 0.51)
  Top 0.152: C219.2 38.61,22.86 37.34,21.59 36.83,21.59 U201.8 36.58,21.34 34.29,21.34 R201.6 | C214.2 40.13,16.26 | D203.C 31.24,7.62 31.5,7.37 U204.4 34.8,4.83 | 34.8,4.83 U204.2 | 34.8,4.83 34.8,10.92 35.56,10.92 U203.3 35.81,11.18 40.89,11.18 40.89,11.43 41.66,12.19 41.66,12.45 U201.1 41.66,12.7 41.66,13.46 40.39,14.73 40.39,15.37 40.02,15.73 C214.2 | v40.01,17.91 40.02,17.89 C214.2 | R201.8 R201.7 R201.6 | R201.6 R201.5
  Top 1.524: D204.1 49.2,31.8 v50.67,33.27 | v38.73,35.31 38.73,36.8 D205.1
  Bottom 0.152: U201.8 40.01,18.2 v40.01,17.91
  Bottom 1.524: v50.67,33.27 51.69,34.29 v48.77,36.83
  other vias: 44.7,37.85 45.72,37.85 46.74,37.85 47.75,37.85 48.77,37.85 45.72,36.83 46.74,36.83 47.75,36.83 49.02,38.86 49.02,39.88 49.02,3.3 49.02,4.32 44.7,6.35 45.72,6.35 46.74,6.35 47.75,6.35 48.77,6.35 44.7,5.33 45.72,5.33 46.74,5.33 47.75,5.33 48.77,5.33
  pour Bottom (no thermals): 29.21,43.18 60.96,42.93 60.96,-0.25 29.21,0
  pour Top (no thermals): 44.45,40.64 49.28,40.64 49.28,35.56 44.45,35.56
  pour Top (no thermals): 44.45,2.54 44.45,7.62 49.28,7.62 49.28,2.54
RESET  (via drill 0.33)
  Top 0.152: J002.3 16.51,8.79 14.15,6.43 14.15,3.99 JP3.3 | v12.24,25.3 12.7,25.76 13.21,25.76 C002.1 | v11.05,25.68 11.05,26.44 10.92,26.57 | U401.29 2.79,15.6 | v3.81,32.89 3.81,34.27 3.45,34.62 3,34.62 2.64,34.27 2.64,30.81 3.35,30.1 3.35,24.46 v3.71,24.11 | J003.13 3.81,8.89 4.22,9.3 | 4.22,9.3 5.26,10.34 5.26,11.43 4.57,11.43 4.57,12.01 4.6,12.01 R429.2 2.79,12.09 2.79,15.6 | v4.32,9.2 4.22,9.3 | 2.79,15.6 2.79,16.31 v3,16.51
  Top 0.406: 10.92,26.57 S429.P$2
  Bottom 0.152: v12.24,25.3 11.43,25.3 v11.05,25.68 11,25.73 11,30.1 8.2,32.89 v3.81,32.89 | v3.71,24.11 3.71,17.22 v3,16.51 | JP3.3 10.57,1.27 9.3,2.54 8.48,2.54 7.52,3.5 7.52,5.99 v4.32,9.2
RXLED1
  Top 0.152: U001.22 3.99,32.19 3.99,25.4 D022.C
TXLED1
  Top 0.152: D023.C 4.29,26.42 4.29,31.54 U001.23
VBUS  (via drill 0.33)
  Top 0.152: v8.31,13.16 8.31,14.43 7.67,15.06 7.47,15.06 7.11,15.42 7.11,16.2 8.28,17.37 v8.28,19.15 | v6.1,22.61 6.1,27.08 10.19,31.17 10.19,38.96 J001.1 | 12.32,6.35 D003.A 11.94,6.35 11.94,6.6 11.81,6.73 11.81,6.86 v10.77,7.9
  Bottom 0.152: v10.77,7.9 10.77,10.69 v8.31,13.16 | v8.28,19.15 8.28,21.01 6.68,22.61 v6.1,22.61
VCC  (via drill 0.33)
  Top 0.152: 9.09,24.64 R001.6 | U001.20 5.26,33.48 5.79,33.48 6.48,32.79 6.48,30.23 v6.6,30.23 | U001.4 12.52,30.23 v10.06,30.23 10.67,30.84 10.67,34.04 v10.92,34.29 | 3.15,10.79 1.91,10.79 J003.12 | 3.15,10.79 4.57,10.79 R429.1 | C404.1 C406.1 9.7,10.11 10.08,10.49 U401.6 | C404.1 8.36,9.98 8.36,9.93 8.38,9.91 | U002.4 7.32,8.69 7.32,9.63 v7.42,9.73 7.75,10.06 C404.1 | 8.51,11.71 U401.4 8.49,10.01 8.38,9.91 | JP4.3 7.34,4.8 7.34,5.92 U002.3 7.32,6.04 7.39,5.97 8.64,5.97 C203.1 8.69,6.02 10.08,6.02 10.41,6.35 D003.K 9.6,6.07 v9.6,7.54 | v3.15,10.24 3.15,10.79 | v10.24,17.07 10.24,18.54 10.82,19.13 10.82,20.24 U401.18 10.87,20.3 10.87,21.74 10.82,21.79 C418.1 10.78,21.99 10.67,22.1 9.78,22.1 9.78,24.64 | 8.38,9.91 8.38,10.16 | 9.78,24.64 R001.6 8.87,24.64 R001.6 | v10.19,25.35 10.19,24.64 9.78,24.64 | R001.6 R001.7 R001.8
  Bottom 0.152: 19.3,15.24 19.3,20.32 | 19.3,20.32 19.3,25.4 | 19.3,15.24 U202.7 | 19.3,15.24 19.3,2.79 v17.78,1.27 | 19.3,25.4 U202.3 | 19.3,20.32 U202.5 | 19.3,25.4 19.3,30.48 U202.1 21.59,39.62 17.78,39.62 17.78,38.86 17.02,38.1 14.73,38.1 v10.92,34.29 | v6.6,30.23 v10.06,30.23 10.19,30.23 v10.19,25.35 | v9.6,7.54 v7.42,9.73 8,10.31 8,10.79 7.72,11.07 7.72,13.39 8.08,13.74 8.53,13.74 8.76,13.51 10.24,14.99 v10.24,17.07 | v3.15,10.24 3.15,5.74 5.08,3.81 JP4.3
VDD  (via drill 0.33, 0.51)
  Top 0.152: D205.3 38.1,41.4 | 38.61,16.26 C214.1 38.72,15.26 v39.24,14.73 | U204.1 38.61,2.03 38.61,2.54 | v31.01,21.87 29.46,20.32 U202.12
  Top 1.524: M2.1 arc-90 58.17,3.05 58.17,6.35 | 58.17,6.35 arc-90 58.16,6.36 | 58.29,37.34 58.67,37.34 58.8,37.21 D201.C | 58.17,6.35 58.55,5.97 D202.C | D205.3 39.85,41.43 v39.88,41.4 | 58.67,25.15 58.55,25.27 52.58,25.27 49.15,28.7 46.1,28.7 44.55,30.25 D204.3 | 38.61,2.54 v35.94,2.54
  Top 3.556: M1.1 58.67,37.34 58.67,25.15 BAT.1 M2.1
  Bottom 0.152: U202.12 31.5,20.32 31.5,16 31.24,16 30.48,15.24 | U202.16 31.5,30.48 31.5,25.4 31.27,25.4 | 30.48,15.24 33.27,12.45 39.24,12.45 v39.24,14.73 | 30.48,15.24 U202.10 | 39.24,1.27 38.61,1.27 | 31.27,25.4 U202.14 | v31.01,21.87 31.27,21.87 31.27,25.4
  Bottom 1.372: 39.24,1.27 39.37,1.14 50.04,1.14 50.67,1.78
  Bottom 1.524: v39.88,41.4 50.16,41.4 50.67,40.89 50.67,39.37 52.7,37.34 55.37,37.34 M1.1 | U201.4 39.18,16.45 39.24,16.38 v39.24,14.73 39.12,2.54 | 39.12,2.54 v35.94,2.54 38.61,2.54 arc90 39.12,3.05 39.12,2.54 | 39.12,2.54 arc-90 39.24,2.41 39.24,1.27 | 50.67,1.78 50.67,4.32 51.94,5.59 56.13,5.59 58.67,3.05 M2.1
VIN  (via drill 0.33)
  Top 0.152: 4.06,5.97 5.31,5.97 5.38,6.04 U002.1 | 4.06,5.97 C201.1 4.01,5.92 3.38,5.92 J003.15 | U002.5 6.35,8.43 5.79,7.87 4.83,7.87 v4.6,8.1 | 4.57,5.33 4.6,5.31 v4.6,5.11 4.6,5.44 4.06,5.97
  Bottom 0.152: v4.6,5.11 v4.6,8.1

### Text on the board
tPlace: D13 | D12 | ~ | 3V3 | D11 | ~ | REF | D10 | -M1+ | A0 | ~ | D9 | A1 | D8 | A2 | D7 | R | T | ~ | A3 | P | D6 | L | ~ | A4 | D5 | A5 | D4 | ~ | A6 | D3 | -BAT+ | A7 | D2 | 5V | GND | RST | RST | -M2+ | GND | RX0 | VIN | TX1
bPlace: stkwans.blogspot.com | a division of Kwan Systems | the terminally ADD | St Kwan's Home for | past this point! | Project Arisa | No electrons permitted | 5 Aug 2011 | Arduino Engine Room